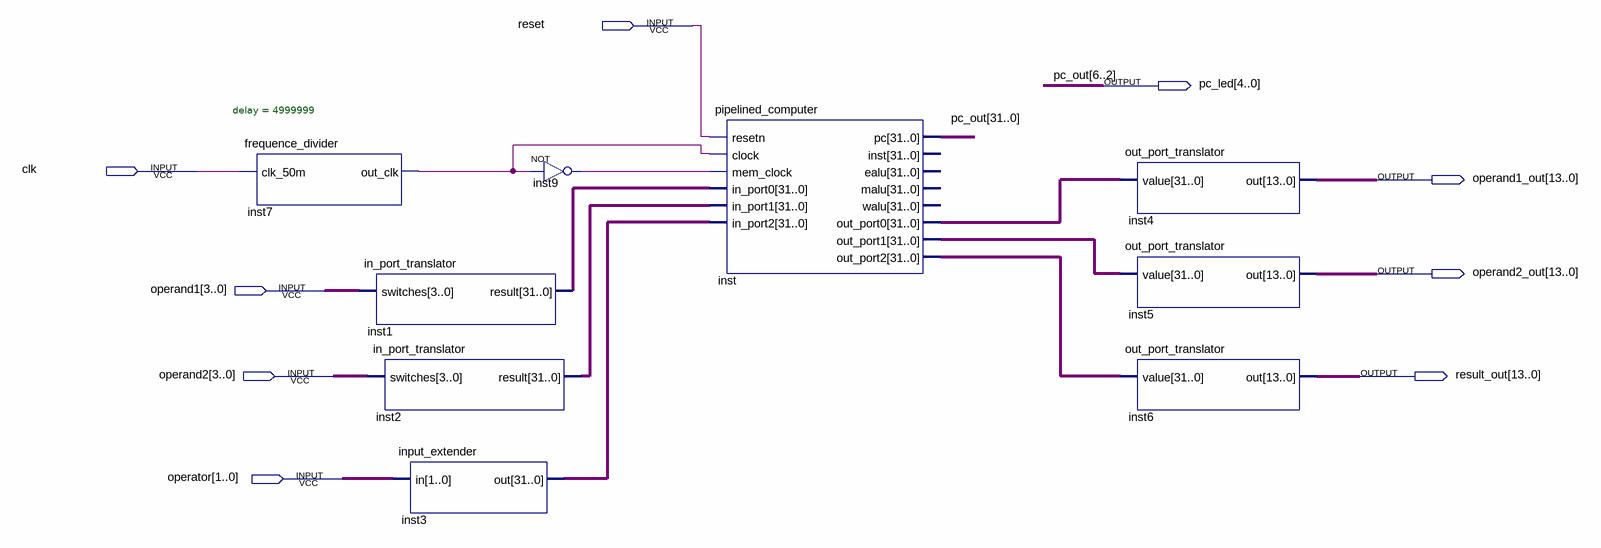
[diagram p0: schematic sheet]
// Quartus schematic pipelined_computer_with_io.bdf as structural Verilog: 9 symbols, 9 pins
module pipelined_computer_with_io (
  input  reset,
  input  clk,
  input  [3:0] operand1,
  input  [3:0] operand2,
  input  [1:0] operator,
  output [4:0] pc_led,
  output [13:0] operand1_out,
  output [13:0] operand2_out,
  output [13:0] result_out
);

  wire inst7_out_clk, inst9_out;
  wire [31:0] inst1_result, inst2_result, inst3_out, inst_out_port0, inst_out_port1, inst_out_port2, pc_out;

  frequence_divider #(.delay(4999999)) inst7 (.clk_50m(clk), .out_clk(inst7_out_clk));
  in_port_translator inst1 (.switches(operand1), .result(inst1_result));
  in_port_translator inst2 (.switches(operand2), .result(inst2_result));
  input_extender inst3 (.in(operator), .out(inst3_out));
  not inst9 (inst9_out, inst7_out_clk);
  pipelined_computer inst (
    .resetn(reset), .clock(inst7_out_clk), .mem_clock(inst9_out), .in_port0(inst1_result),
    .in_port1(inst2_result), .in_port2(inst3_out), .pc({pc_out[31:7], pc_led, pc_out[1:0]}),
    .out_port0(inst_out_port0), .out_port1(inst_out_port1), .out_port2(inst_out_port2));  // open: inst, ealu, malu, walu
  out_port_translator inst4 (.value(inst_out_port0), .out(operand1_out));
  out_port_translator inst5 (.value(inst_out_port1), .out(operand2_out));
  out_port_translator inst6 (.value(inst_out_port2), .out(result_out));

  // Other names for the same wires on the sheet: pc_out[6:2] = pc_led
endmodule
